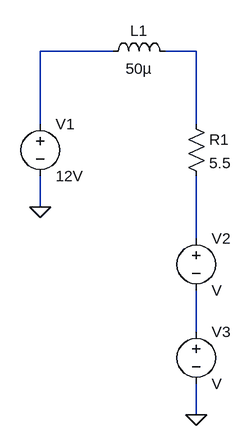
[diagram p0: schematic motor_model.asc]
motor_model.asc, the LTspice schematic file:
Version 4
SHEET 1 880 680
WIRE 112 0 0 0
WIRE 240 0 192 0
WIRE 0 112 0 0
WIRE 240 112 240 0
WIRE 0 240 0 192
WIRE 240 288 240 192
WIRE 240 432 240 368
WIRE 240 560 240 512
FLAG 0 240 0
FLAG 240 560 0
SYMBOL voltage 0 96 R0
WINDOW 123 0 0 Left 0
WINDOW 39 0 0 Left 0
SYMATTR InstName V1
SYMATTR Value 12V
SYMBOL voltage 240 272 R0
SYMATTR InstName V2
SYMBOL voltage 240 416 R0
SYMATTR InstName V3
SYMBOL ind 96 16 R270
WINDOW 0 32 56 VTop 2
WINDOW 3 5 56 VBottom 2
SYMATTR InstName L1
SYMATTR Value 50µ
SYMBOL res 224 96 R0
SYMATTR InstName R1
SYMATTR Value 5.5

The netlist it stands for:
* motor_model.asc
V1 N001 0 12V
V2 N003 N004 V
V3 N004 0 V
L1 N001 N002 50µ
R1 N002 N003 5.5
.backanno
.end